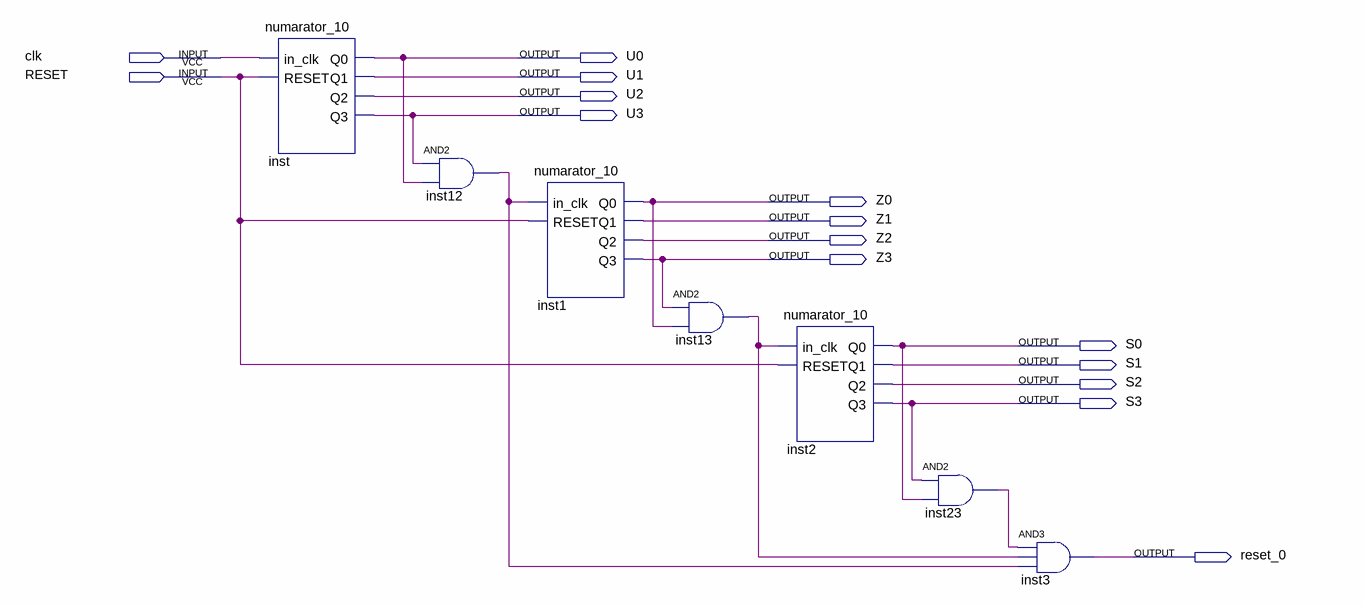
[diagram p0: schematic sheet]
// Quartus schematic numarator_1000.bdf as structural Verilog: 7 symbols, 15 pins
module numarator_1000 (
  input  clk,
  input  RESET,
  output U0,
  output U1,
  output U2,
  output U3,
  output Z0,
  output Z1,
  output Z2,
  output Z3,
  output S0,
  output S1,
  output S2,
  output S3,
  output reset_0
);

  wire inst12_out, inst13_out, inst23_out;

  numarator_10 inst (.in_clk(clk), .RESET(RESET), .Q0(U0), .Q1(U1), .Q2(U2), .Q3(U3));
  and inst12 (inst12_out, U3, U0);
  numarator_10 inst1 (.in_clk(inst12_out), .RESET(RESET), .Q0(Z0), .Q1(Z1), .Q2(Z2), .Q3(Z3));
  and inst13 (inst13_out, Z3, Z0);
  numarator_10 inst2 (.in_clk(inst13_out), .RESET(RESET), .Q0(S0), .Q1(S1), .Q2(S2), .Q3(S3));
  and inst23 (inst23_out, S3, S0);
  and inst3 (reset_0, inst23_out, inst13_out, inst12_out);
endmodule
